# EAGLE design SCART CONECTOR (EAGLE 7.6.0)
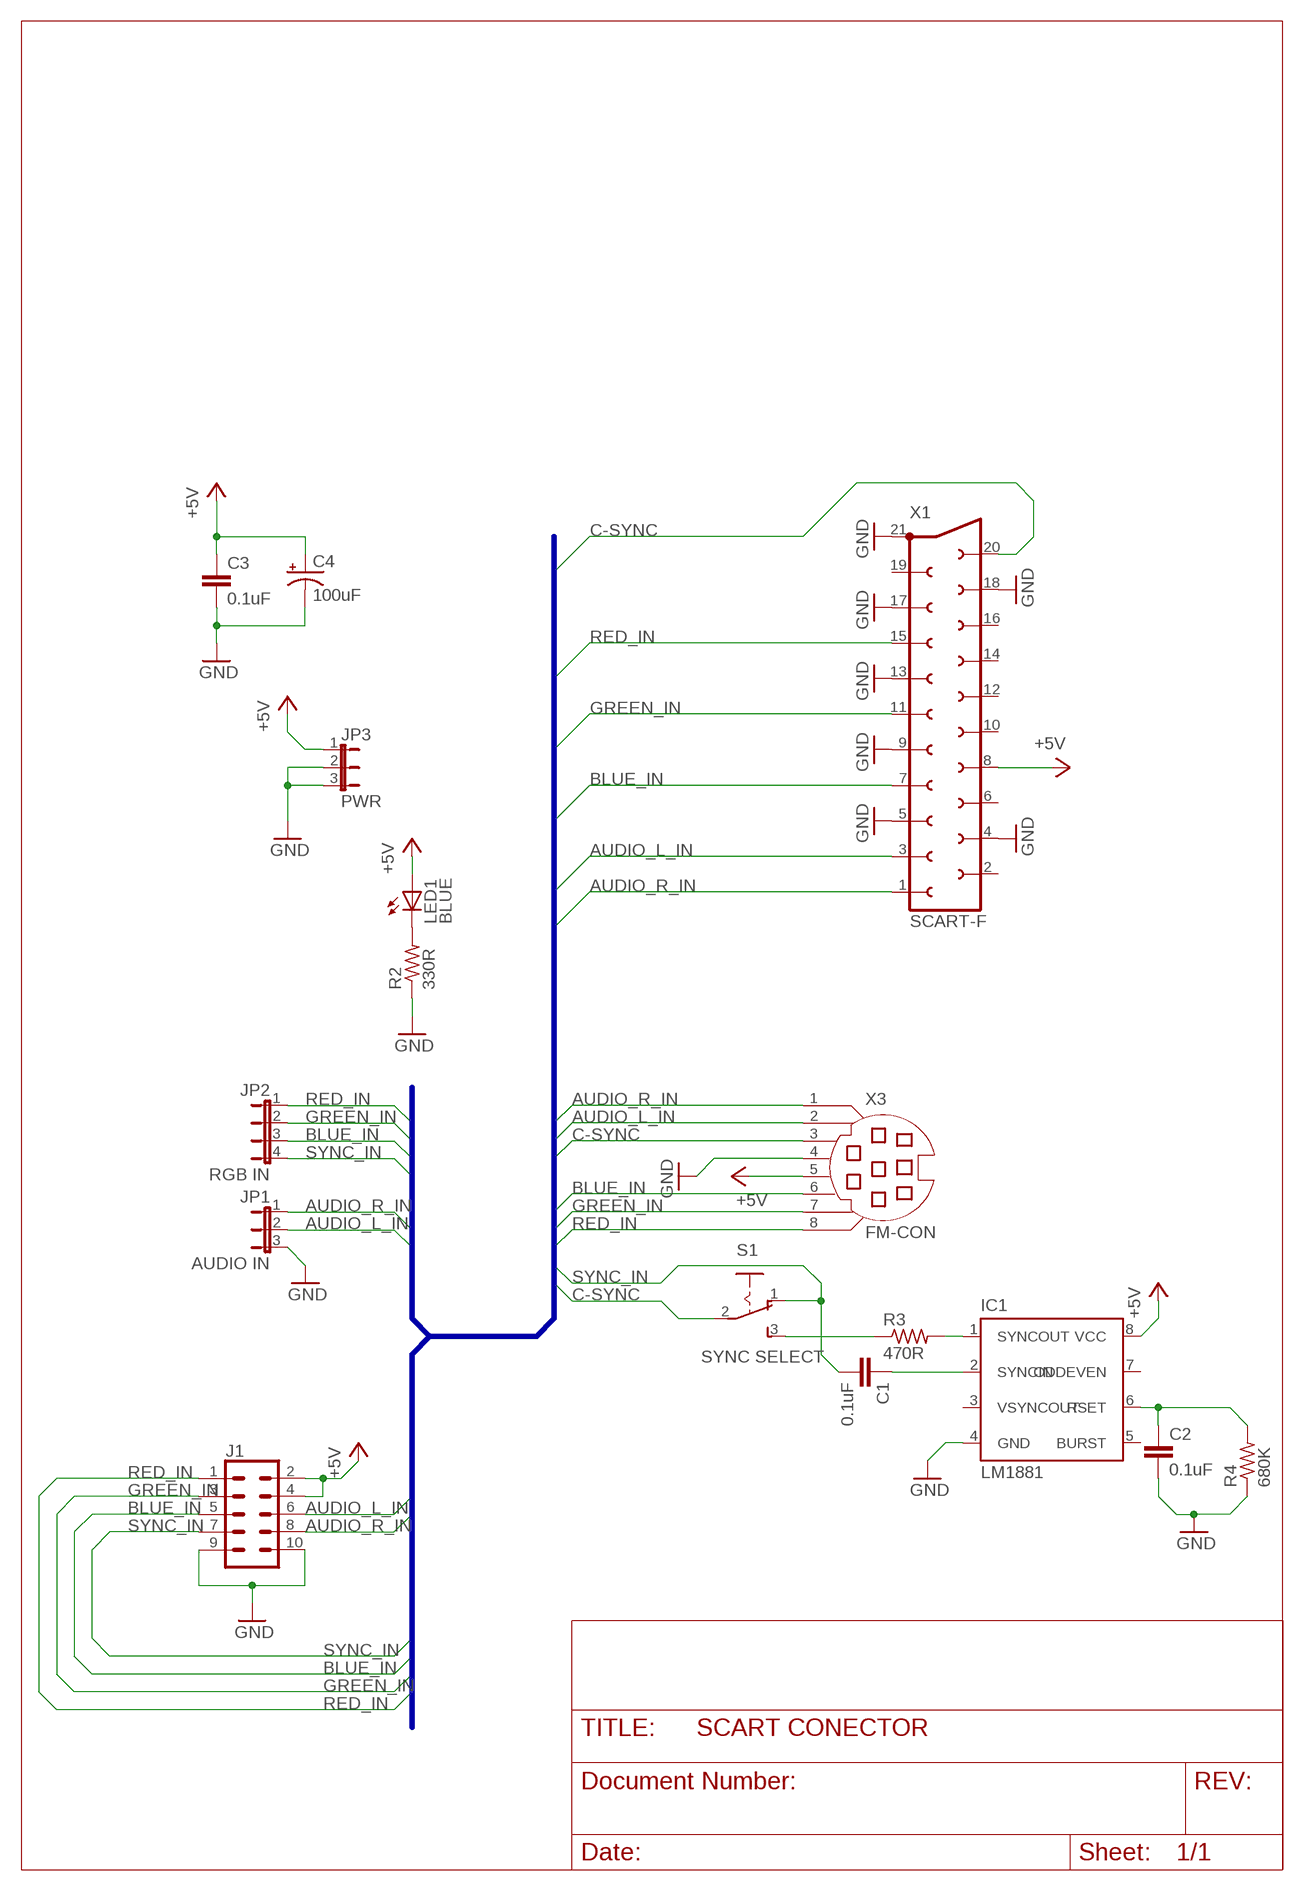
[diagram p0: schematic, sheet 1]

## Parts
C1  0.1uF  C7.5/3  [C7.5B3]
C2  0.1uF  C7.5/3  [C7.5B3]
C3  0.1uF  C7.5/3  [C7.5B3]
C4  100uF  CPOL-USE5-13  [E5-13]
IC1  LM1881  [DIL08]
J1  CONN_05X2SHD-NS  [2X5-SHROUDED-NS]
JP1  AUDIO IN  JP2E  [JP2]
JP2  RGB IN  JP4E  [JP4]
JP3  PWR  JP2E  [JP2]
LED1  BLUE  LED5MM  [LED5MM]
R2  330R  R-US_0204/7  [0204/7]
R3  470R  R-US_0204/7  [0204/7]
R4  680K  R-US_0204/7  [0204/7]
S1  SYNC SELECT  255SB  [255SB]
X1  SCART-F  [SCART-F]
X3  FM-CON  MD08SS  [MDIN08SS]

## Nets
+5V [SINGAL]: C3.1 C4.+ IC1.8(VCC) J1.2 J1.4 JP3.1 LED1.A X1.8 X3.5
AUDIO_L_IN [SINGAL]: J1.6 JP1.2 X1.3 X3.2
AUDIO_R_IN [SINGAL]: J1.8 JP1.1 X1.1 X3.1
BLUE_IN [SINGAL]: J1.5 JP2.3 X1.7 X3.6
C-SYNC [SINGAL]: S1.2(P) X1.20 X3.3
GND [SINGAL]: C2.2 C3.2 C4.- IC1.4(GND) J1.9 J1.10 JP1.3 JP3.2 JP3.3 R2.1 R4.1 X1.4 X1.5 X1.9 X1.13 X1.17 X1.18 X1.21 X3.4
GREEN_IN [SINGAL]: J1.3 JP2.2 X1.11 X3.7
N$2 [SINGAL]: R3.1 S1.3(S)
N$3 [SINGAL]: IC1.1(SYNCOUT) R3.2
N$4: LED1.K(C) R2.2
N$5 [SINGAL]: C1.1 IC1.2(SYNCIN)
N$6 [SINGAL]: C2.1 IC1.6(RSET) R4.2
RED_IN [SINGAL]: J1.1 JP2.1 X1.15 X3.8
SYNC_IN [SINGAL]: C1.2 J1.7 JP2.4 S1.1(O)
Unconnected: IC1.3(VSYNCOUT) IC1.5(BURST) IC1.7(ODDEVEN) X1.2 X1.6 X1.10 X1.12 X1.14 X1.16 X1.19

## Buses
B$1

## Library data of the parts
C1-C3 = capacitor-wima:C: CAPACITOR naming: grid - package width
C4 = rcl:CPOL-US: POLARIZED CAPACITOR, American symbol
IC1 = lm1881:LM1881
J1 = SparkFun-Connectors:CONN_05X2: Multi connection point. Often used as Generic Header-pin footprint for 0.1 inch spaced/style header connections For AVR SPI programming port, see special device with nice symbol: "AVR_SPI_PROG_5x2.dev" You can populate with any combo of single row headers, but if you'd like an exact match, check these: 2x5 AVR ICSP Male Header <https://www.sparkfun.com/products/778> (PRT-00778) 2x5 Pin Shrouded Header <https://www.sparkfun.com/products/8506> (PRT-08506) On any of the 0.1 inch spaced packages, you can populate with these: Break Away Headers - Straight <https://www.sparkfun.com/products/116> (PRT-00116) Break Away Male Headers - Right Angle <https://www.sparkfun.com/products/553> (PRT-00553) Female Headers <https://www.sparkfun.com/products/115> (PRT-00115) Break Away Headers - Machine Pin <https://www.sparkfun.com/products/117> (PRT-00117) Break Away Female Headers - Swiss Machine Pin <https://www.sparkfun.com/products/743> (PRT-00743) Special note: the shrouded connector mates well with our 5x2 ribbon cables: 2x5 Pin IDC Ribbon Cable <https://www.sparkfun.com/products/8535> (PRT-08535); PROD_ID: CONN-08671; SF_ID: PRT-08506
JP1 JP3 = jumper:JP2E: JUMPER
JP2 = jumper:JP4E: JUMPER
LED1 = led:LED: LED OSRAM: - CHIPLED LG R971, LG N971, LY N971, LG Q971, LY Q971, LO R971, LY R971 LH N974, LH R974 LS Q976, LO Q976, LY Q976 LO Q996 - Hyper CHIPLED LW Q18S LB Q993, LB Q99A, LB R99A - SideLED LS A670, LO A670, LY A670, LG A670, LP A670 LB A673, LV A673, LT A673, LW A673 LH A674 LY A675 LS A676, LA A676, LO A676, LY A676, LW A676 LS A679, LY A679, LG A679 - Hyper Micro SIDELED® LS Y876, LA Y876, LO Y876, LY Y876 LT Y87S - SmartLED LW L88C, LW L88S LB L89C, LB L89S, LG L890 LS L89K, LO L89K, LY L89K LS L896, LA L896, LO L896, LY L896 - TOPLED LS T670, LO T670, LY T670, LG T670, LP T670 LSG T670, LSP T670, LSY T670, LOP T670, LYG T670 LG T671, LOG T671, LSG T671 LB T673, LV T673, LT T673, LW T673 LH T674 LS T676, LA T676, LO T676, LY T676, LB T676, LH T676, LSB T676, LW T676 LB T67C, LV T67C, LT T67C, LS T67K, LO T67K, LY T67K, LW E67C LS E67B, LA E67B, LO E67B, LY E67B, LB E67C, LV E67C, LT E67C LW T67C LS T679, LY T679, LG T679 LS T770, LO T770, LY T770, LG T770, LP T770 LB T773, LV T773, LT T773, LW T773 LH T774 LS E675, LA E675, LY E675, LS T675 LS T776, LA T776, LO T776, LY T776, LB T776 LHGB T686 LT T68C, LB T68C - Hyper Mini TOPLED® LB M676 - Mini TOPLED Santana® LG M470 LS M47K, LO M47K, LY M47K Source: http://www.osram.convergy.de LUXEON: - LUMILED® LXK2-PW12-R00, LXK2-PW12-S00, LXK2-PW14-U00, LXK2-PW14-V00 LXK2-PM12-R00, LXK2-PM12-S00, LXK2-PM14-U00 LXK2-PE12-Q00, LXK2-PE12-R00, LXK2-PE12-S00, LXK2-PE14-T00, LXK2-PE14-U00 LXK2-PB12-K00, LXK2-PB12-L00, LXK2-PB12-M00, LXK2-PB14-N00, LXK2-PB14-P00, LXK2-PB14-Q00 LXK2-PR12-L00, LXK2-PR12-M00, LXK2-PR14-Q00, LXK2-PR14-R00 LXK2-PD12-Q00, LXK2-PD12-R00, LXK2-PD12-S00 LXK2-PH12-R00, LXK2-PH12-S00 LXK2-PL12-P00, LXK2-PL12-Q00, LXK2-PL12-R00 Source: www.luxeon.com KINGBRIGHT: KA-3528ASYC Source: www.kingbright.com
R2-R4 = rcl:R-US_: RESISTOR, American symbol
S1 = switch:255SB: SLIDING SWITCH Distributor Buerklin, 11G810
X1 = con-hirschmann:SCART-F: TV SCART CONNECTOR; OC_FARNELL: unknown; OC_NEWARK: unknown
X3 = con-yamaichi:MD08SS: YAMAICHI CONNECTOR; OC_FARNELL: unknown; OC_NEWARK: unknown

## Net classes
1 SINGAL: width 0.5 mm

## Board
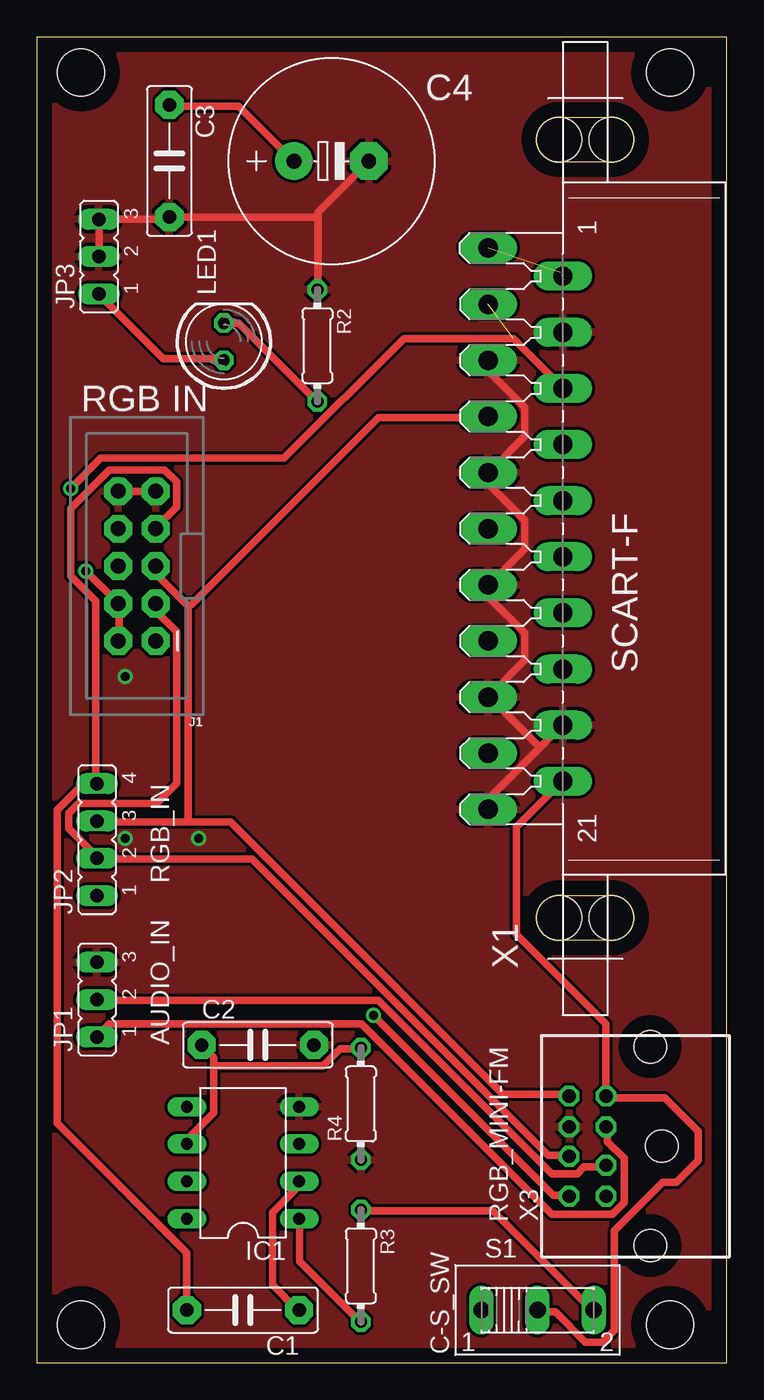
[diagram p1: board, top side]
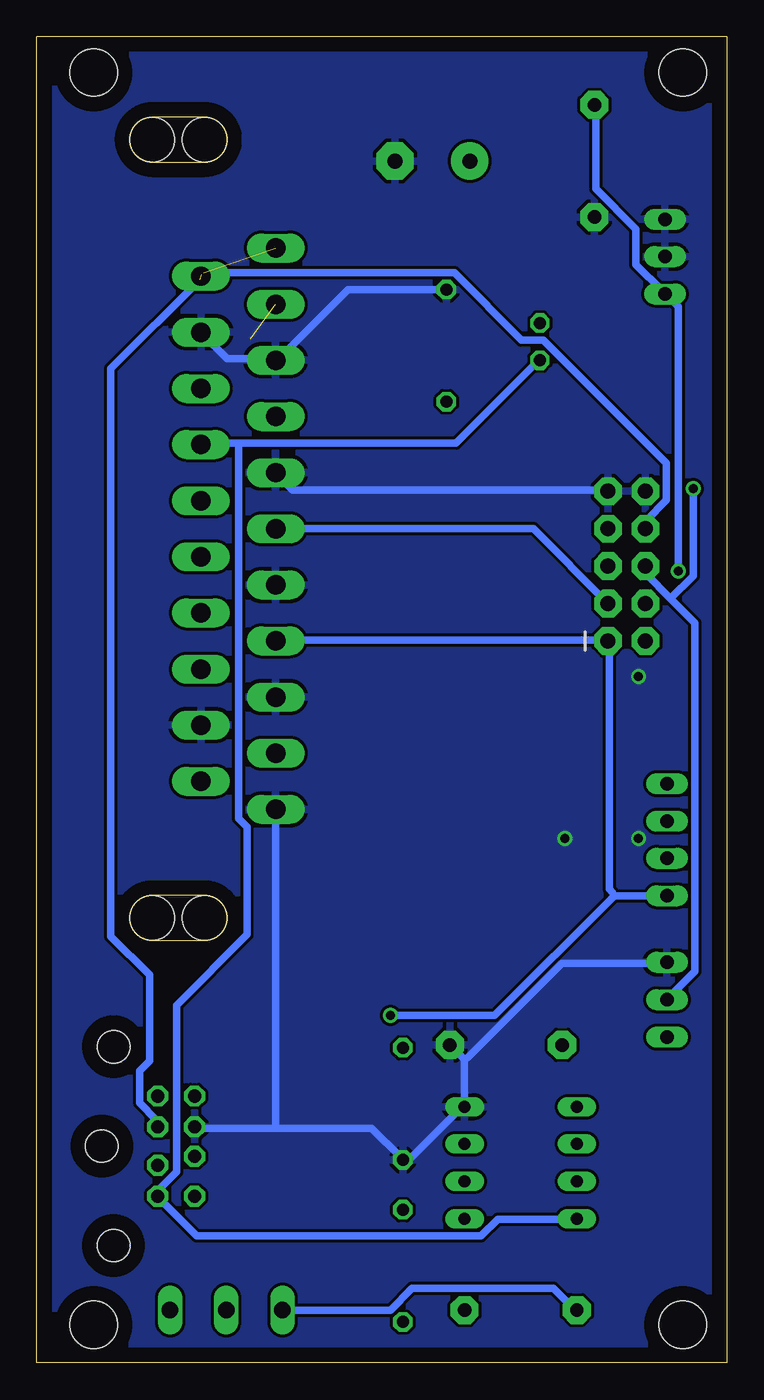
[diagram p2: board, bottom side, seen from below]

Size 46.86 x 90 mm. Coordinates in mm from the lower left corner, seen from the top.
Outline: 0,0 46.86,0 46.86,90 0,90 0,0
Copper layers (1*16): Top 0.035mm / dielectric 1.5mm / Bottom 0.035mm
Design rules "default": minimum track width 10mil, minimum drill 24mil, track to track 8mil, track to pad 8mil, pad to pad 8mil, via to via 8mil, smd to smd 8mil, copper to edge 40mil, drill to drill 8mil, minimum pad ring 10mil, minimum via ring 8mil, stop-mask expansion 4mil, vias tented up to drill 0mil, thermal gap 10mil
Holes 3.2 mm at 43,2.57 3,2.57 3,87.57 43,87.57

### Footprints (pad centres in the part's own frame; a part is rotated, then mirrored left to right if it is on the bottom)
C7.5B3 = drill 0.914 pad 1.905 octagon: 1 -3.81,0; 2 3.81,0
E5-13 = drill 1.016 pad 2.54: + -2.54,0 | drill 1.016 pad 2.54 octagon: - 2.54,0
DIL08 = drill 0.813 long: 1 -3.81,-3.81; 2 -1.27,-3.81; 3 1.27,-3.81; 4 3.81,-3.81; 5 3.81,3.81; 6 1.27,3.81; 7 -1.27,3.81; 8 -3.81,3.81
2X5-SHROUDED-NS = drill 1.016 pad 1.88 octagon: 1 -1.27,5.08; 2 1.27,5.08; 3 -1.27,2.54; 4 1.27,2.54; 5 -1.27,0; 6 1.27,0; 7 -1.27,-2.54; 8 1.27,-2.54; 9 -1.27,-5.08; 10 1.27,-5.08
JP2 = drill 0.914 long: 1 -2.54,0; 2 0,0; 3 2.54,0
JP4 = drill 0.914 long: 1 -3.81,0; 2 -1.27,0; 3 1.27,0; 4 3.81,0
LED5MM = drill 0.813 octagon: A -1.27,0; K 1.27,0
0204/7 = drill 0.813 octagon: 1 -3.81,0; 2 3.81,0
255SB = drill 1.118 long: 1 -3.81,0; 2 0,0; 3 3.81,0
SCART-F = drill 1.321 long: 1 19.05,5.08; 2 17.145,0; 3 15.24,5.08; 4 13.335,0; 5 11.43,5.08; 6 9.525,0; 7 7.62,5.08; 8 5.715,0; 9 3.81,5.08; 10 1.905,0; 11 0,5.08; 12 -1.905,0; 13 -3.81,5.08; 14 -5.715,0; 15 -7.62,5.08; 16 -9.525,0; 17 -11.43,5.08; 18 -13.335,0; 19 -15.24,5.08; 20 -17.145,0; 21 -19.05,5.08 | hole 3.023: 26.416,0.254; 26.416,-3.302; -26.416,0.254; -26.416,-3.302
MDIN08SS = drill 0.9 octagon: 1 1.3,8.5; 2 -1.3,8.5; 3 3.4,8.5; 4 1.3,11; 5 -3.4,8.5; 6 3.4,11; 7 -0.7,11; 8 -3.4,11 | hole 2.2: -6.75,5.5; 0,4.7; 6.75,5.5

### Placement (x,y rotation side)
C1  14,3.57 180 top
C2  15,21.57 0 top
C3  9,81.57 270 top
C4  20,81.57 0 top
IC1  14,13.57 90 top
J1  6.8,54.07 180 top
JP1  4.08,24.64 90 top
JP2  4.08,35.5 90 top
JP3  4.21,75.08 90 top
LED1  12.7,69.31 90 top
R2  19.05,69.04 270 top
R3  22,6.57 270 top
R4  22,17.57 90 top
S1  34,3.57 0 top
X1  35.72,56.61 90 top
X3  47.15,14.7 90 top

### Tracks (layer width: path | path; a pad name or v marks a point on that pad's centre or on a via)
+5V  (via drill 0.61)
  Top 0.5: C3.1 9.03,85.29 13.72,85.29 17.37,81.64 C4.+ | J1.2 5.6,49.06 5.6,51.46 J1.4 5.37,51.69 v3.31,53.75 | LED1.A 12.69,68.15 8.57,68.15 4.23,72.49 JP3.1
  Bottom 0.5: IC1.8 10.29,9.74 15.54,9.74 16.69,8.6 36.01,8.6 38.63,11.23 X3.5 38.52,11.46 38.52,11.8 37.38,12.94 37.38,24.26 32.58,29.06 32.58,36.38 33.15,36.95 33.15,62.44 | 33.15,62.44 18.4,62.44 12.8,68.04 LED1.A | 33.15,62.44 35.66,62.44 X1.8 | v3.31,53.75 3.31,71.69 4.12,72.49 JP3.1 4.34,72.72 6.17,74.55 6.17,76.95 8.91,79.69 8.91,85.29 C3.1
AUDIO_L_IN  (via drill 0.61)  (1 unrouted)
  Top 0.5: X3.2 38.63,13.29 37.15,13.29 36.69,12.83 34.98,12.83 23.2,24.6 4.12,24.6 JP1.2 | 35.66,66.21 32.35,69.52 24.92,69.52 16.8,61.41 4.34,61.41 v2.29,59.35
  Bottom 0.5: 3.83,51.86 2.17,50.2 2.17,26.55 4,24.72 JP1.2 | 3.83,51.86 5.49,53.52 5.49,53.98 J1.6 | v2.29,59.35 2.29,53.41 3.83,51.86
AUDIO_R_IN  (2 unrouted)
  Top 0.5: X3.1 38.75,15.91 38.75,15 39.89,13.86 39.89,10.89 39.09,10.09 34.98,10.09 22.06,23 4.92,23 4.12,22.2 JP1.1
  Bottom 0.5: 35.66,73.86 35.55,73.98 18.52,73.98 13.95,69.41 12.46,69.41 4.12,61.06 4.12,58.55 5.49,57.18 5.49,56.72 J1.8 | 35.78,73.52 41.83,67.46 41.83,28.95 39.2,26.32 39.2,20.49 39.89,19.8 39.89,17.63 38.75,16.49 38.75,16.03 X3.1
BLUE_IN
  Top 0.5: 10.29,36.72 4.12,36.72 JP2.3 | 10.29,36.72 13.14,36.72 31.66,18.2 36.12,18.2 X3.6 | 10.29,51.35 8.12,53.52 8.12,53.98 J1.5 | 10.29,36.72 10.29,51.35 | X1.7 30.63,64.15 23.2,64.15 10.52,51.46 10.29,51.35
C-SYNC
  Top 0.5: X1.20 35.66,39.46 32.58,36.38 32.58,29.06 38.63,23 38.63,18.2 X3.3 38.86,17.97 42.63,17.97 44.92,15.69 44.92,13.74 43.43,12.26 42.52,12.26 39.2,8.94 39.2,2.2 38.41,1.4 37.26,1.4 35.2,3.46 34.06,3.46 S1.2
GND  (via drill 0.61)
  Top 0.5: JP3.2 4.23,75.12 4.23,77.52 JP3.3 4.46,77.64 8.8,77.64 8.91,77.75 C3.2 9.14,77.75 19.09,77.75 | 19.09,77.75 19.09,78.09 22.52,81.52 C4.- | 19.09,77.75 19.09,72.95 R2.1 | J1.10 5.6,59.12 8,59.12 J1.9 | 34.18,41.75 35.66,43.23 X1.18 | 34.18,41.75 30.75,38.32 30.75,37.63 X1.21 | 34.18,41.75 30.75,45.18 X1.17 30.86,45.4 33.15,47.69 33.15,49.52 30.75,51.92 30.75,52.72 X1.13 30.86,52.95 33.15,55.23 33.15,57.18 30.75,59.58 30.75,60.38 X1.9 30.86,60.61 33.15,62.89 33.15,64.83 30.75,67.24 30.75,68.04 X1.5
  Bottom 0.5: 17.83,20.6 17.83,17.4 IC1.4 18.06,17.29 21.49,13.86 21.95,13.86 R4.1 22.17,13.97 24.12,15.91 30.63,15.91 | 17.83,20.6 18.75,21.52 C2.2 | 30.63,15.91 36.12,15.91 X3.4 | JP1.3 4.12,27.12 11.2,27.12 17.6,20.71 17.83,20.6 | X1.4 35.66,69.86 33.95,68.15 30.75,68.15 X1.5 30.4,68.15 25.72,72.84 19.09,72.84 R2.1 | J1.9 8.12,59.23 29.49,59.23 30.63,60.38 X1.9 | 30.63,15.91 30.63,37.52 X1.21
  other vias: 6,46.57 6,35.57 11,35.57
  pour Top: 0,89.57 46,89.57 46,0.57 0,0.57
  pour Bottom: 0,89.57 46,89.57 46,0.57 0,0.57
GREEN_IN
  Top 0.5: X3.7 36.12,14.09 34.75,14.09 14.63,34.2 4.12,34.2 JP2.2 4,34.43 2.17,36.26 2.17,37.29 2.86,37.98 8.14,37.98 9.49,39.32 9.49,49.63 8.12,51.01 8.12,51.46 J1.3
  Bottom 0.5: X1.11 13.14,56.61 8.12,51.58 J1.3
N$2
  Top 0.5: R3.1 22.06,10.31 30.98,10.31 37.72,3.57 S1.3
N$3
  Top 0.5: IC1.1 17.83,9.74 17.83,6.89 21.95,2.77 R3.2
N$4
  Top 0.254: 12.8,70.55 LED1.K | 18.97,65.29 R2.2
  Top 0.5: 12.8,70.55 13.72,70.55 18.97,65.29
N$5
  Top 0.5: IC1.2 17.72,12.26 17.72,11.91 16,10.2 16,5.29 17.72,3.57 C1.1
N$6
  Top 0.5: 12,20.14 12,20.71 11.2,21.52 C2.1 | 12,20.14 12,16.94 10.29,15.23 10.29,14.89 IC1.6 | 12,20.14 19.43,20.14 20.57,21.29 21.95,21.29 R4.2
RED_IN  (via drill 0.61)
  Top 0.5: v22.86,23.57 35.09,11.34 36.12,11.34 X3.8
  Bottom 0.5: v22.86,23.57 15.77,23.57 7.66,31.69 | 7.66,31.69 4.12,31.69 JP2.1 | 7.66,31.69 7.77,31.92 8,32.15 8,48.95 J1.1 8.23,49.06 30.63,49.06 X1.15
SYNC_IN
  Top 0.5: J1.7 8.12,56.72 9.49,58.09 9.49,59.81 8.69,60.61 4.92,60.61 2.29,57.98 2.29,53.41 4,51.69 4,39.35 JP2.4 3.77,39.23 3.09,39.23 1.37,37.52 1.37,16.26 10.17,7.46 10.17,3.57 C1.2
  Bottom 0.5: S1.1 30.18,3.57 22.86,3.57 21.37,5.06 11.77,5.06 10.29,3.57 C1.2

### Text on the board
tPlace: RGB IN | RGB_IN | AUDIO_IN | RGB_MINI-FM | C-S_SW